# EAGLE design controller (EAGLE 6.6.0)
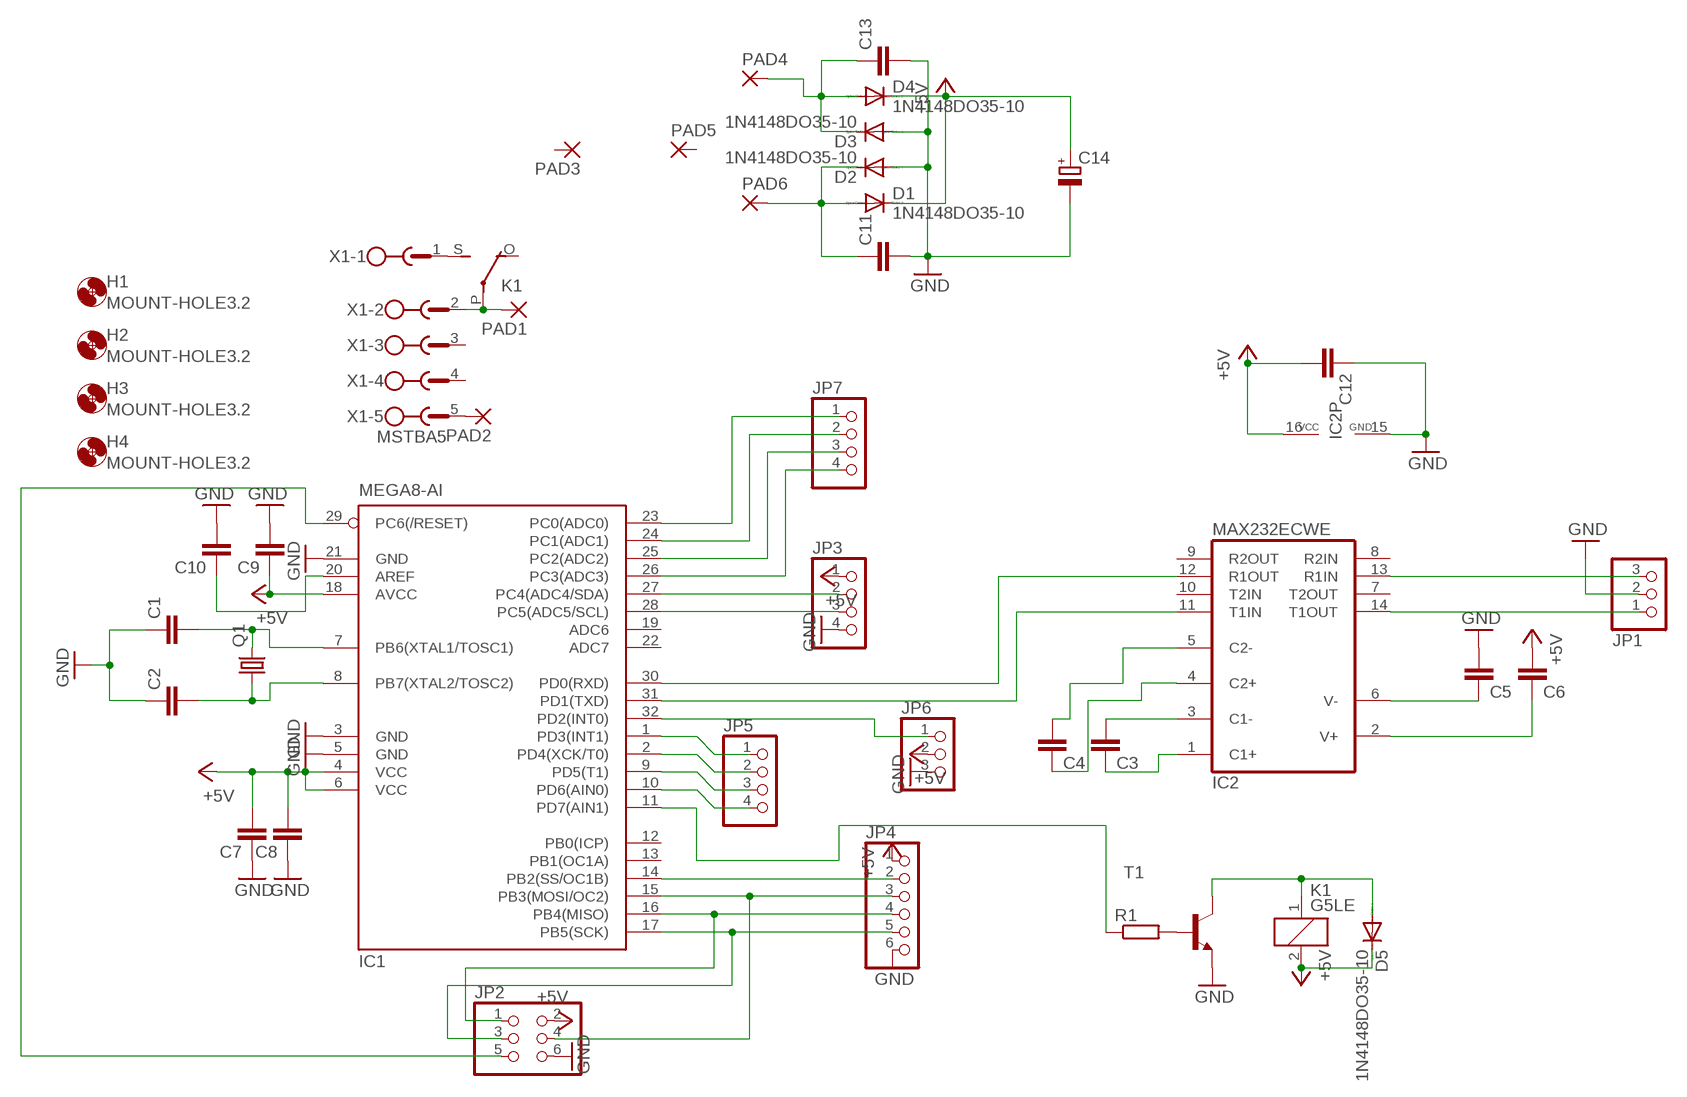
[diagram p0: schematic, sheet 1]

## Parts
C1  C-EUC0805  [C0805]
C2  C-EUC0805  [C0805]
C3  C-EUC0805  [C0805]
C4  C-EUC0805  [C0805]
C5  C-EUC0805  [C0805]
C6  C-EUC0805  [C0805]
C7  C-EUC0805  [C0805]
C8  C-EUC0805  [C0805]
C9  C-EUC0805  [C0805]
C10  C-EUC0805  [C0805]
C11  C-EU050-025X075  [C050-025X075]
C12  C-EUC0805  [C0805]
C13  C-EU050-025X075  [C050-025X075]
C14  CPOL-EUE7.5-18  [E7,5-18]
D1  1N4148DO35-10  [DO35-10]
D2  1N4148DO35-10  [DO35-10]
D3  1N4148DO35-10  [DO35-10]
D4  1N4148DO35-10  [DO35-10]
D5  1N4148DO35-10  [DO35-10]
H1  MOUNT-HOLE3.2  [3,2]
H2  MOUNT-HOLE3.2  [3,2]
H3  MOUNT-HOLE3.2  [3,2]
H4  MOUNT-HOLE3.2  [3,2]
IC1  MEGA8-AI  [TQFP32-08]
IC2  MAX232ECWE  [SO16]
JP1  PINHD-1X3  [1X03]
JP2  PINHD-2X3  [2X03]
JP3  PINHD-1X4  [1X04]
JP4  PINHD-1X6  [1X06]
JP5  PINHD-1X4  [1X04]
JP6  PINHD-1X3  [1X03]
JP7  PINHD-1X4  [1X04]
K1  G5LE  [G5LE]
PAD1  3,81/1,4  [3,81/1,4]
PAD2  3,81/1,4  [3,81/1,4]
PAD3  3,81/1,4  [3,81/1,4]
PAD4  3,81/1,4  [3,81/1,4]
PAD5  3,81/1,4  [3,81/1,4]
PAD6  3,81/1,4  [3,81/1,4]
Q1  CRYSTALHC49S  [HC49/S]
R1  R-EU_0207/10  [0207/10]
T1  BC547A-NPN-TO92-CBE  [TO92-CBE]
X1  MSTBA5  [MSTBA5]

## Nets
+5V: C6.2 C7.2 C8.2 C9.1 C12.2 C14.+ D1.C D4.C D5.C IC1.4(VCC) IC1.6(VCC) IC1.18(AVCC) IC2.16(VCC) JP2.2 JP3.1 JP4.1 JP6.2 K1.2
GND: C1.1 C2.1 C5.2 C7.1 C8.1 C9.2 C10.2 C11.2 C12.1 C13.2 C14.- D2.A D3.A IC1.3(GND) IC1.5(GND) IC1.21(GND) IC2.15(GND) JP1.2 JP2.6 JP3.4 JP4.6 JP6.3 T1.E
N$1: C2.2 IC1.8(PB7(XTAL2/TOSC2)) Q1.1
N$2: C1.2 IC1.7(PB6(XTAL1/TOSC1)) Q1.2
N$3: IC1.30(PD0(RXD)) IC2.12(R1OUT)
N$4: IC1.31(PD1(TXD)) IC2.11(T1IN)
N$5: C3.2 IC2.3(C1-)
N$6: C3.1 IC2.1(C1+)
N$7: C4.1 IC2.4(C2+)
N$8: C4.2 IC2.5(C2-)
N$9: C5.1 IC2.6(V-)
N$10: C6.1 IC2.2(V+)
N$11: K1.P(2:P) PAD1.1(P) X1.2
N$12: IC2.14(T1OUT) JP1.1
N$13: IC2.13(R1IN) JP1.3
N$14: IC1.16(PB4(MISO)) JP2.1 JP4.4
N$15: IC1.17(PB5(SCK)) JP2.3 JP4.5
N$16: IC1.29(PC6(/RESET)) JP2.5
N$17: IC1.15(PB3(MOSI/OC2)) JP2.4 JP4.3
N$18: C10.1 IC1.20(AREF)
N$19: IC1.23(PC0(ADC0)) JP7.1
N$20: IC1.24(PC1(ADC1)) JP7.2
N$21: IC1.25(PC2(ADC2)) JP7.3
N$22: IC1.26(PC3(ADC3)) JP7.4
N$23: IC1.27(PC4(ADC4/SDA)) JP3.2
N$24: IC1.28(PC5(ADC5/SCL)) JP3.3
N$25: IC1.14(PB2(SS/OC1B)) JP4.2
N$26: IC1.32(PD2(INT0)) JP6.1
N$27: R1.2 T1.B
N$28: IC1.2(PD4(XCK/T0)) JP5.2
N$29: IC1.9(PD5(T1)) JP5.3
N$30: IC1.10(PD6(AIN0)) JP5.4
N$31: IC1.11(PD7(AIN1)) R1.1
N$32: K1.S(2:S) X1.1
N$33: PAD2.1(P) X1.5
N$34: C11.1 D1.A D2.C PAD6.1(P)
N$35: IC1.1(PD3(INT1)) JP5.1
N$36: C13.1 D3.C D4.A PAD4.1(P)
N$37: D5.A K1.1 T1.C
Unconnected: IC1.12(PB0(ICP)) IC1.13(PB1(OC1A)) IC1.19(ADC6) IC1.22(ADC7) IC2.7(T2OUT) IC2.8(R2IN) IC2.9(R2OUT) IC2.10(T2IN) K1.O(2:O) PAD3.1(P) PAD5.1(P) X1.3 X1.4

## Library data of the parts
C1-C13 = rcl:C-EU: CAPACITOR, European symbol
C14 = rcl:CPOL-EU: POLARIZED CAPACITOR, European symbol
D1-D5 = diode:1N4148: DIODE high speed (Philips)
H1-H4 = holes:MOUNT-HOLE: MOUNTING HOLE with drill center marker
IC1 = atmel:MEGA8: MICROCONTROLLER 8 Kbytes FLASH, 1 kbytes SRAM, 512 bytes EEPROM, USART, 6-channel 10 bit ADC, 2-channel 8 bit ADC Pin compatible with Atmega48, ATMega88, ATMega168 Source: avr.lbr; MPN: ATMEGA8-16AU; OC_FARNELL: 9171371; OC_NEWARK: 73M8863
IC2 = maxim:MAX232ECWE: RS232 TRANSEIVER
JP1 JP6 = pinhead:PINHD-1X3: PIN HEADER
JP2 = pinhead:PINHD-2X3: PIN HEADER
JP3 JP5 JP7 = pinhead:PINHD-1X4: PIN HEADER
JP4 = pinhead:PINHD-1X6: PIN HEADER
K1 = relay:G5LE: RELAY 1 x switch, 10 A/120 V AC, 8 A/30 V DC, Omron; OC_FARNELL: unknown; OC_NEWARK: unknown
PAD1-PAD6 = wirepad:3,81/1,4: THROUGH-HOLE PAD
Q1 = crystal:CRYSTAL: CRYSTAL; OC_FARNELL: 1667008; OC_NEWARK: unknown
R1 = resistor:R-EU_: RESISTOR, European symbol
T1 = transistor:*-NPN-: NPN Transistror BF959 corrected 2008.03.06
X1 = con-phoenix-508:MSTBA5: PHOENIX; MPN: 1757271; OC_FARNELL: 3705201; OC_NEWARK: 71C4164

## Board
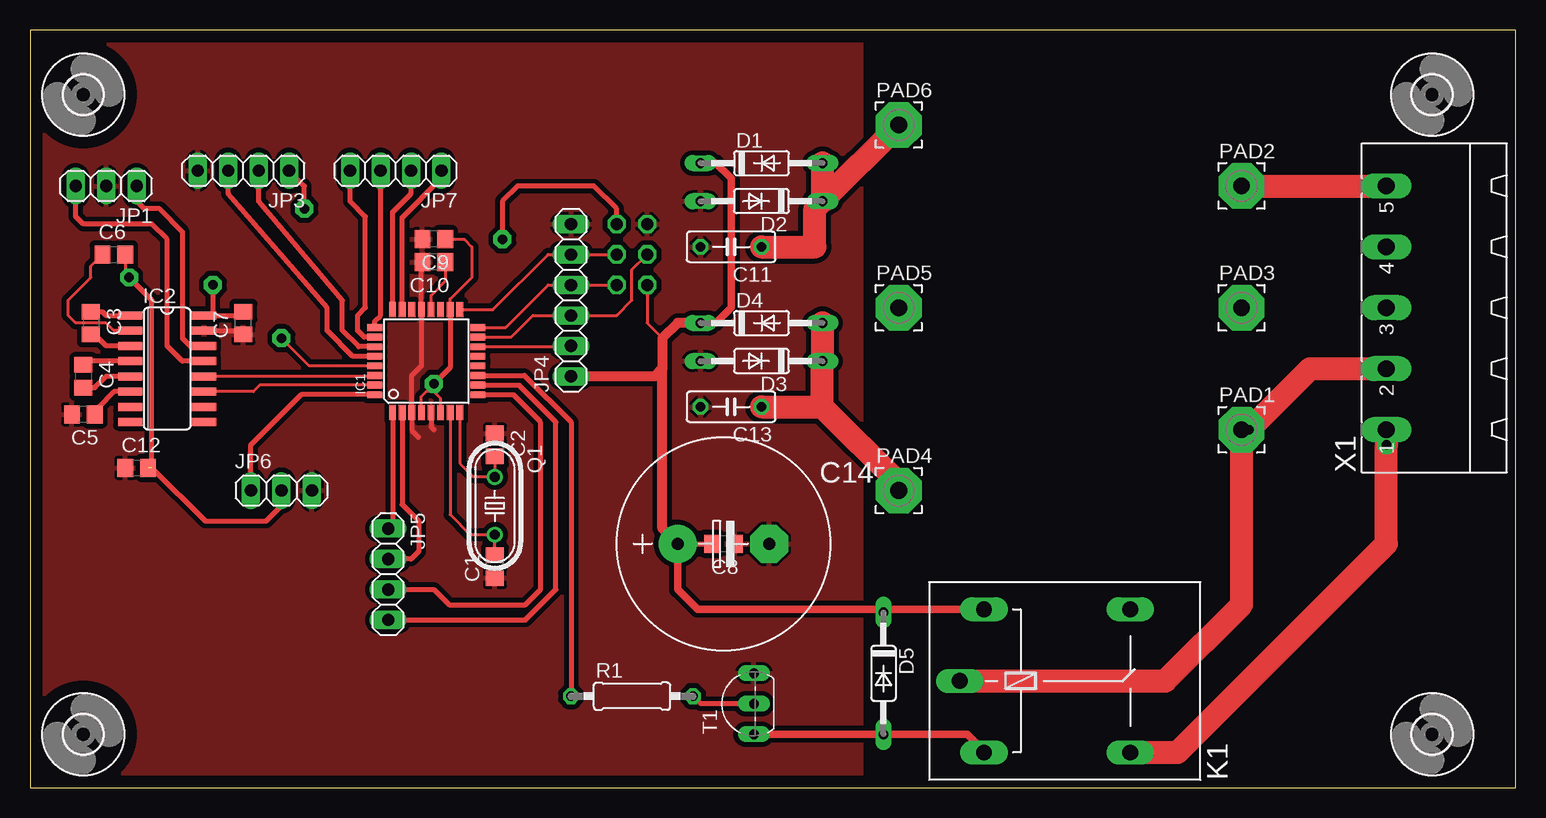
[diagram p1: board, top side]
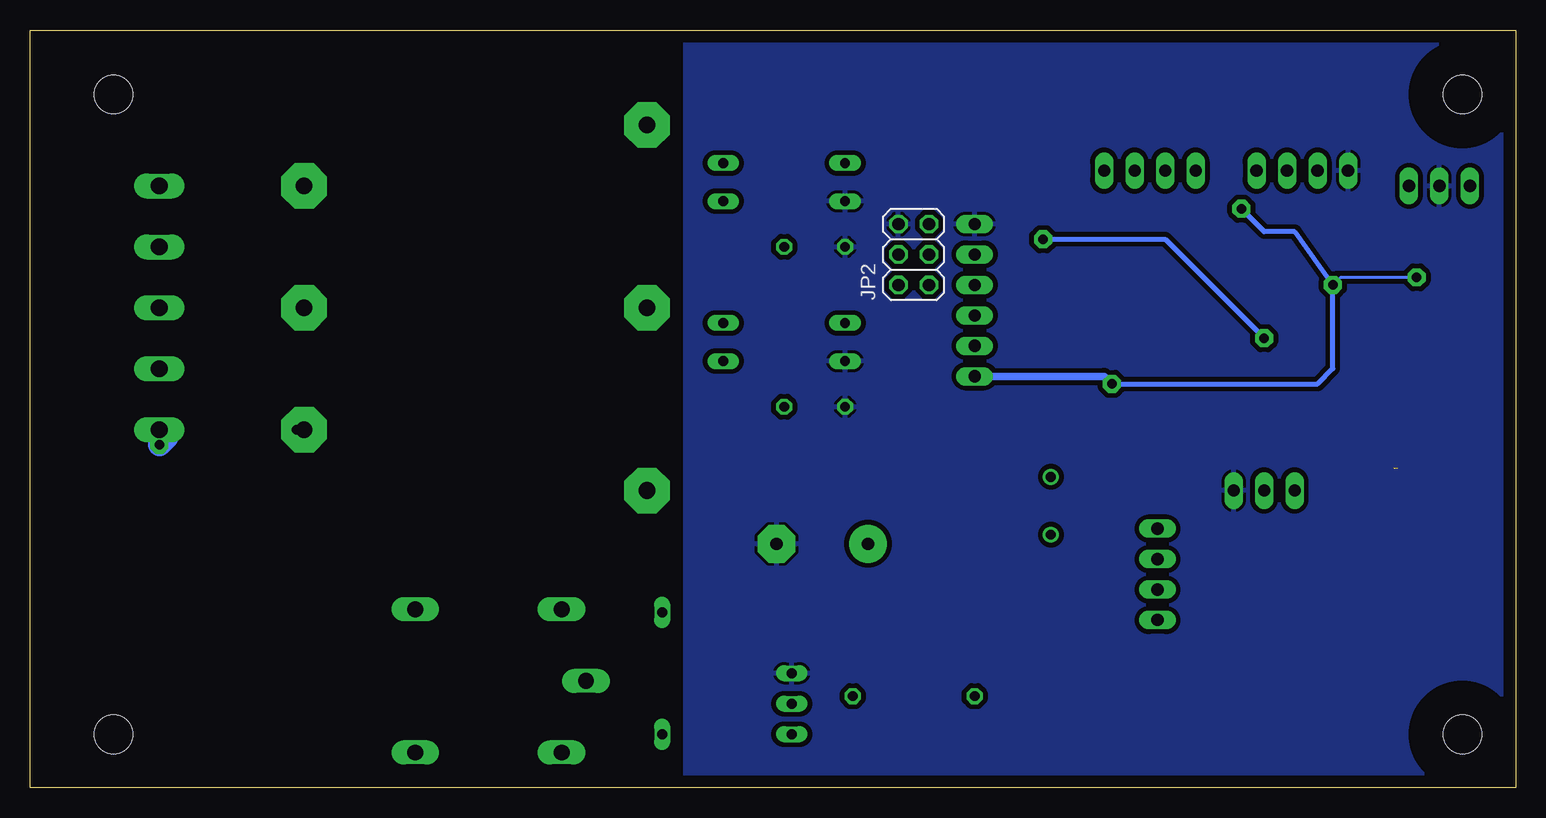
[diagram p2: board, bottom side, seen from below]

Size 123.81 x 63.17 mm. Coordinates in mm from the lower left corner, seen from the top.
Outline: 0,0 123.81,0 123.81,63.17 0,63.17 0,0
Copper layers (1*16): Top 0.035mm / dielectric 1.5mm / Bottom 0.035mm
Design rules "default": minimum track width 8mil, minimum drill 0.8mm, track to track 7mil, track to pad 7mil, pad to pad 7mil, via to via 21mil, smd to smd 0mil, copper to edge 40mil, drill to drill 8mil, minimum pad ring 10mil, minimum via ring 8mil, stop-mask expansion 4mil, vias tented up to drill 0mil, thermal gap 10mil

### Footprints (pad centres in the part's own frame; a part is rotated, then mirrored left to right if it is on the bottom)
C0805 = smd 1.3 x 1.5: 1 -0.95,0; 2 0.95,0
C050-025X075 = drill 0.813 octagon: 1 -2.54,0; 2 2.54,0
E7,5-18 = drill 1.016 pad 3.15: + -3.81,0 | drill 1.016 pad 3.15 octagon: - 3.81,0
DO35-10 = drill 0.813 long: A 5.08,0; C -5.08,0
3,2 = hole 3.2: 0,0
TQFP32-08 = smd 1.27 x 0.559: 1 -4.293,2.8; 2 -4.293,2; 3 -4.293,1.2; 4 -4.293,0.4; 5 -4.293,-0.4; 6 -4.293,-1.2; 7 -4.293,-2; 8 -4.293,-2.8; 17 4.293,-2.8; 18 4.293,-2; 19 4.293,-1.2; 20 4.293,-0.4; 21 4.293,0.4; 22 4.293,1.2; 23 4.293,2; 24 4.293,2.8 | smd 0.559 x 1.27: 9 -2.8,-4.293; 10 -2,-4.293; 11 -1.2,-4.293; 12 -0.4,-4.293; 13 0.4,-4.293; 14 1.2,-4.293; 15 2,-4.293; 16 2.8,-4.293; 25 2.8,4.293; 26 2,4.293; 27 1.2,4.293; 28 0.4,4.293; 29 -0.4,4.293; 30 -1.2,4.293; 31 -2,4.293; 32 -2.8,4.293
SO16 = smd 0.66 x 2.032: 1 -4.445,-3.073; 2 -3.175,-3.073; 3 -1.905,-3.073; 4 -0.635,-3.073; 5 0.635,-3.073; 6 1.905,-3.073; 7 3.175,-3.073; 8 4.445,-3.073; 9 4.445,3.073; 10 3.175,3.073; 11 1.905,3.073; 12 0.635,3.073; 13 -0.635,3.073; 14 -1.905,3.073; 15 -3.175,3.073; 16 -4.445,3.073
1X03 = drill 1.016 long: 1 -2.54,0; 2 0,0; 3 2.54,0
2X03 = drill 1.016 octagon: 1 -2.54,-1.27; 2 -2.54,1.27; 3 0,-1.27; 4 0,1.27; 5 2.54,-1.27; 6 2.54,1.27
1X04 = drill 1.016 long: 1 -3.81,0; 2 -1.27,0; 3 1.27,0; 4 3.81,0
1X06 = drill 1.016 long: 1 -6.35,0; 2 -3.81,0; 3 -1.27,0; 4 1.27,0; 5 3.81,0; 6 6.35,0
G5LE = drill 1.321 long: 1 -7.493,-5.969; 2 -7.493,5.969; O 4.699,5.969; P -9.525,0; S 4.699,-5.969
3,81/1,4 = drill 1.397 pad 3.81 octagon: 1 0,0
HC49/S = drill 0.813: 1 -2.413,0; 2 2.413,0
0207/10 = drill 0.813 octagon: 1 -5.08,0; 2 5.08,0
TO92-CBE = drill 0.813 long: B 0,0; C -2.54,0; E 2.54,0
MSTBA5 = drill 1.397 long: 1 -10.16,5.08; 2 -5.08,5.08; 3 0,5.08; 4 5.08,5.08; 5 10.16,5.08

### Placement (x,y rotation side)
C1  38.73,18.41 90 top
C2  38.73,28.57 270 top
C3  5.08,38.73 270 top
C4  4.45,34.29 270 top
C5  4.45,31.11 180 top
C6  6.99,44.45 0 top
C7  17.78,38.73 90 top
C8  57.78,20.32 180 top
C9  33.66,45.72 180 top
C10  33.66,43.81 180 top
C11  58.42,45.09 180 top
C12  8.89,26.67 0 top
C13  58.42,31.75 180 top
C14  57.78,20.32 0 top
D1  60.96,52.07 0 top
D2  60.96,48.9 180 top
D3  60.96,35.56 180 top
D4  60.96,38.73 0 top
D5  71.12,9.53 270 top
H1  4.45,57.78 0 top
H2  4.45,4.45 0 top
H3  116.84,4.45 0 top
H4  116.84,57.78 0 top
IC1  33.02,35.56 90 top
IC2  11.43,34.92 270 top
JP1  6.35,50.16 180 top
JP2  50.16,44.45 90 bottom
JP3  17.78,51.44 180 top
JP4  45.09,40.64 90 top
JP5  29.84,17.78 270 top
JP6  20.95,24.77 0 top
JP7  30.48,51.44 180 top
K1  87,8.89 0 top
PAD1  100.97,29.84 0 top
PAD2  100.97,50.16 0 top
PAD3  100.97,40.01 0 top
PAD4  72.39,24.77 0 top
PAD5  72.39,40.01 0 top
PAD6  72.39,55.24 0 top
Q1  38.73,23.5 270 top
R1  50.16,7.62 0 top
T1  60.33,6.99 90 top
X1  118.11,40.01 90 top

### Tracks (layer width: path | path; a pad name or v marks a point on that pad's centre or on a via)
+5V  (via drill 0.79 pad 1.5)  (1 unrouted)
  Top 0.254: C6.2 7.93,42.87 v8.26,42.55 | IC1.4 32.62,32.62 33.02,33.02 33.66,33.02 | IC1.6 34.22,32.45 33.66,33.02 | 33.66,33.02 v33.66,33.66 | IC1.18 35.02,40.73 36.83,42.55 36.83,45.09 36.2,45.72 C9.1 34.92,46.04 | JP2.2 51.44,38.73 52.7,37.47
  Top 0.406: IC2.16 15.24,39.37 | 15.24,39.37 17.46,39.37 C7.2 | v15.24,41.91 15.24,39.37 | IC1.18 35.02,35.02 v33.66,33.66 | v8.26,42.55 10.16,40.64 10.16,26.67 14.61,22.23 19.68,22.23 20.95,23.5 JP6.2 | v22.86,48.26 22.86,50.16 JP3.1 | C14.+ C8.2
  Top 0.61: D1.C 57.15,52.07 58.42,50.8 58.42,40.01 57.15,38.73 D4.C | K1.2 71.12,14.86 | 71.12,14.86 55.63,14.86 53.98,16.51 C14.+ | D5.C 71.12,14.86
  Top 0.813: D4.C 53.98,38.73 52.7,37.47 52.7,34.92 | 52.7,34.92 52.07,34.29 JP4.1 | C14.+ 52.7,21.59 52.7,34.92
  Bottom 0.254: v8.26,42.55 14.61,42.55 v15.24,41.91
  Bottom 0.406: v22.86,48.26 20.95,46.35 18.41,46.35 v15.24,41.91 15.24,34.92 16.51,33.66 v33.66,33.66
  Bottom 0.61: JP4.1 34.29,34.29 v33.66,33.66
GND
  Top 0.406: IC2.15 17.46,38.1 C7.1 | C10.2 32.62,43.73 IC1.21 32.62,35.16 31.82,34.36 IC1.3 31.82,29.77 32.38,29.21 | IC1.5 33.42,30.08 33.66,29.84
  pour Bottom (isolate 0.406): -3.81,64.77 69.22,63.5 69.22,-3.81 -3.81,-3.17
  pour Top (isolate 0.406): -3.81,64.77 69.22,64.14 69.22,-3.81 -3.81,-3.17
N$1
  Top 0.254: IC1.8 35.82,27.05 36.96,25.91 Q1.1 C2.2
N$2
  Top 0.254: IC1.7 35.02,22.77 36.7,21.08 Q1.2 C1.2
N$3
  Top 0.254: 28.66,34.29 IC2.12
  Top 0.406: 28.66,34.29 IC1.30
N$4
  Top 0.254: IC1.31 19.14,33.56 18.61,33.02 IC2.11
N$5
  Top 0.406: IC2.3 6.35,36.83 5.39,37.78 C3.2
N$6
  Top 0.406: C3.1 6.04,39.69 6.35,39.37 IC2.1
N$7
  Top 0.406: IC2.4 4.76,35.56 C4.1
N$8
  Top 0.406: IC2.5 6.35,34.29 5.4,33.34 C4.2
N$9
  Top 0.406: IC2.6 6.99,33.02 5.71,31.75 5.71,31.43 C5.1
N$10
  Top 0.254: IC2.2 6.99,38.1 6.35,38.73 3.81,38.73 3.17,39.37 3.17,40.64 5.08,42.55 5.08,43.49 C6.1
N$11  (via drill 0.79 pad 1.5)
  Top 1.93: K1.P 94.61,8.89 100.97,15.24 PAD1.1 | v101.6,29.84 106.68,34.92 X1.2
  Bottom 1.93: PAD1.1 v101.6,29.84
N$12
  Top 0.406: IC2.14 13.34,36.83 12.7,37.47 12.7,46.35 10.79,48.26 9.53,48.26 8.89,48.9 JP1.1
N$13
  Top 0.406: IC2.13 12.7,35.56 11.43,36.83 11.43,45.72 10.16,46.99 4.45,46.99 3.81,47.62 JP1.3
N$14
  Top 0.254: IC1.16 39.63,38.36 43.18,41.91 JP4.4 JP2.1
N$15
  Top 0.254: IC1.17 38.58,39.85 43.18,44.45 JP4.5 JP2.3
N$16  (via drill 0.79 pad 1.5)
  Top 0.254: IC1.29 23.26,35.16 v20.95,37.47
  Top 0.406: JP2.5 48.9,48.26 46.99,50.16 40.64,50.16 39.37,48.9 v39.37,45.72
  Bottom 0.406: v39.37,45.72 29.21,45.72 v20.95,37.47
N$17
  Top 0.254: IC1.15 40.1,37.56 41.91,39.37 JP4.3 48.9,39.37 50.16,40.64 50.16,43.18 JP2.4
N$18
  Top 0.254: IC1.20 33.42,41.04 34.6,42.23 C10.1
N$19
  Top 0.406: IC1.23 31.02,47.53 34.29,50.8 JP7.1
N$20
  Top 0.406: IC1.24 30.22,48 31.75,49.53 JP7.2
N$21
  Top 0.406: IC1.25 28.73,38.89 29.21,39.37 JP7.3
N$22
  Top 0.406: IC1.26 27.84,37.56 27.3,38.1 27.3,39.37 27.94,40.01 27.94,47.62 26.67,48.9 JP7.4
N$23
  Top 0.406: IC1.27 27.38,36.76 26.04,38.1 26.04,40.64 19.05,48.9 JP3.2
N$24
  Top 0.406: IC1.28 26.91,35.96 24.77,38.1 24.77,40.01 16.51,49.53 JP3.3
N$25
  Top 0.254: IC1.14 45.02,36.76 JP4.2
N$26
  Top 0.406: IC1.32 22.6,32.76 18.41,28.57 JP6.1
N$27
  Top 0.406: T1.B 55.88,6.99 R1.2
N$28
  Top 0.406: IC1.2 31.02,23.59 32.38,22.23 32.38,19.68 31.75,19.05 JP5.2
N$29
  Top 0.406: JP5.3 33.66,16.51 34.92,15.24 41.27,15.24 42.55,16.51 42.55,30.48 40.27,32.76 IC1.9
N$30
  Top 0.406: JP5.4 41.27,13.97 43.81,16.51 43.81,30.48 40.73,33.56 IC1.10
N$31
  Top 0.406: IC1.11 41.2,34.36 45.09,30.48 R1.1
N$32  (via drill 0.79 pad 1.5)
  Top 1.93: K1.S 95.63,2.92 113.03,20.32 v113.03,28.57
  Bottom 1.93: v113.03,28.57 112.39,29.21 X1.1
N$33
  Top 1.93: PAD2.1 X1.5
N$34
  Top 1.93: PAD6.1 D2.C | D2.C 65.41,48.26 65.41,45.09 C11.1 | D1.A D2.C
N$35
  Top 0.406: IC1.1 30.22,21.96 JP5.1
N$36
  Top 1.93: PAD4.1 72.39,25.4 66.04,31.75 | 66.04,31.75 D3.C D4.A | C13.1 66.04,31.75
N$37
  Top 0.406: K1.1 79.5,3.05
  Top 0.61: 79.5,3.05 78.11,4.45 72.39,4.45 D5.A T1.C